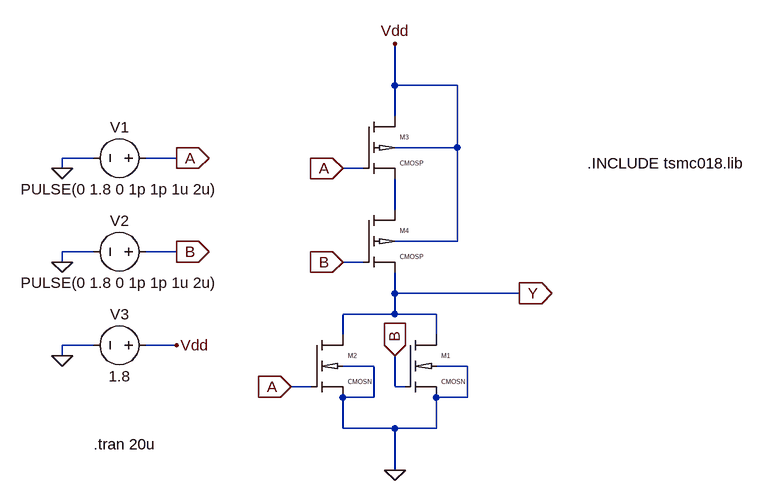
[diagram p0: schematic TASK2_NOR.asc]
TASK2_NOR.asc, the LTspice schematic file:
Version 4
SHEET 1 880 680
WIRE 256 -192 256 -256
WIRE 352 -192 256 -192
WIRE 256 -144 256 -192
WIRE 352 -96 352 -192
WIRE 352 -96 256 -96
WIRE -208 -80 -256 -80
WIRE -80 -80 -128 -80
WIRE -256 -64 -256 -80
WIRE 208 -64 176 -64
WIRE 256 0 256 -48
WIRE 352 48 352 -96
WIRE 352 48 256 48
WIRE -208 64 -256 64
WIRE -80 64 -128 64
WIRE -256 80 -256 64
WIRE 208 80 176 80
WIRE 256 128 256 96
WIRE 448 128 256 128
WIRE 256 160 256 128
WIRE 256 160 176 160
WIRE 320 160 256 160
WIRE 176 192 176 160
WIRE 320 192 320 160
WIRE -208 208 -256 208
WIRE -80 208 -128 208
WIRE -256 224 -256 208
WIRE 224 240 176 240
WIRE 368 240 320 240
WIRE 128 272 96 272
WIRE 256 272 256 224
WIRE 272 272 256 272
WIRE 224 288 224 240
WIRE 224 288 176 288
WIRE 368 288 368 240
WIRE 368 288 320 288
WIRE 176 336 176 288
WIRE 256 336 176 336
WIRE 320 336 320 288
WIRE 320 336 256 336
WIRE 256 400 256 336
FLAG 256 400 0
FLAG 176 -64 A
IOPIN 176 -64 In
FLAG 96 272 A
IOPIN 96 272 In
FLAG 176 80 B
IOPIN 176 80 In
FLAG 256 224 B
IOPIN 256 224 In
FLAG 448 128 Y
IOPIN 448 128 Out
FLAG 256 -256 Vdd
FLAG -256 224 0
FLAG -256 80 0
FLAG -256 -64 0
FLAG -80 -80 A
IOPIN -80 -80 Out
FLAG -80 64 B
IOPIN -80 64 Out
FLAG -80 208 Vdd
SYMBOL Ncmos 272 192 R0
SYMATTR InstName M1
SYMATTR Value2 l=180n w=500n
SYMBOL Ncmos 128 192 R0
SYMATTR InstName M2
SYMATTR Value2 l=180n w=500n
SYMBOL Pcmos 208 -144 R0
SYMATTR InstName M3
SYMATTR Value2 l=180nm w=3400n
SYMBOL Pcmos 208 0 R0
SYMATTR InstName M4
SYMATTR Value2 l=180n w=3400n
SYMBOL voltage -112 -80 R90
WINDOW 0 -32 56 VBottom 2
WINDOW 3 32 56 VTop 2
WINDOW 123 0 0 Left 0
WINDOW 39 0 0 Left 0
SYMATTR InstName V1
SYMATTR Value PULSE(0 1.8 0 1p 1p 1u 2u)
SYMBOL voltage -112 64 R90
WINDOW 0 -32 56 VBottom 2
WINDOW 3 32 56 VTop 2
WINDOW 123 0 0 Left 0
WINDOW 39 0 0 Left 0
SYMATTR InstName V2
SYMATTR Value PULSE(0 1.8 0 1p 1p 1u 2u)
SYMBOL voltage -112 208 R90
WINDOW 0 -32 56 VBottom 2
WINDOW 3 32 56 VTop 2
WINDOW 123 0 0 Left 0
WINDOW 39 0 0 Left 0
SYMATTR InstName V3
SYMATTR Value 1.8
TEXT 552 -72 Left 2 !.INCLUDE tsmc018.lib
TEXT -208 360 Left 2 !.tran 20u

The netlist it stands for:
* TASK2_NOR.asc
M1 Y B 0 0 CMOSN l=180n w=500n
M2 Y A 0 0 CMOSN l=180n w=500n
M3 Vdd A N001 Vdd CMOSP l=180nm w=3400n
M4 N001 B Y Vdd CMOSP l=180n w=3400n
V1 A 0 PULSE(0 1.8 0 1p 1p 1u 2u)
V2 B 0 PULSE(0 1.8 0 1p 1p 1u 2u)
V3 Vdd 0 1.8
.model NMOS NMOS
.model PMOS PMOS
.lib standard.mos
.INCLUDE tsmc018.lib
.tran 20u
.lib tsmc018.lib
.backanno
.end

* Results of the author's LTspice run, read from the files saved beside the schematic
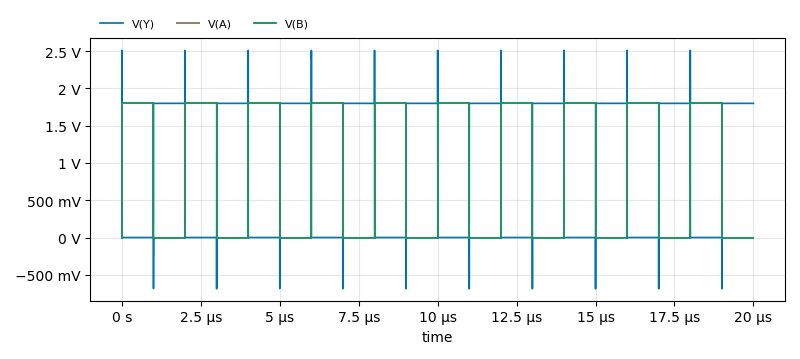
[diagram p1: Transient Analysis of TASK2_NOR.asc, plotted from the saved traces]
* Transient Analysis, 1 run:
*   V(Y): min -688 mV, max 2.511 V, average 900 mV, rms 1.273 V, last 1.8 V
*   V(A): min 0 V, max 1.8 V, average 900 mV, rms 1.273 V, last 0 V
*   V(B): min 0 V, max 1.8 V, average 900 mV, rms 1.273 V, last 0 V